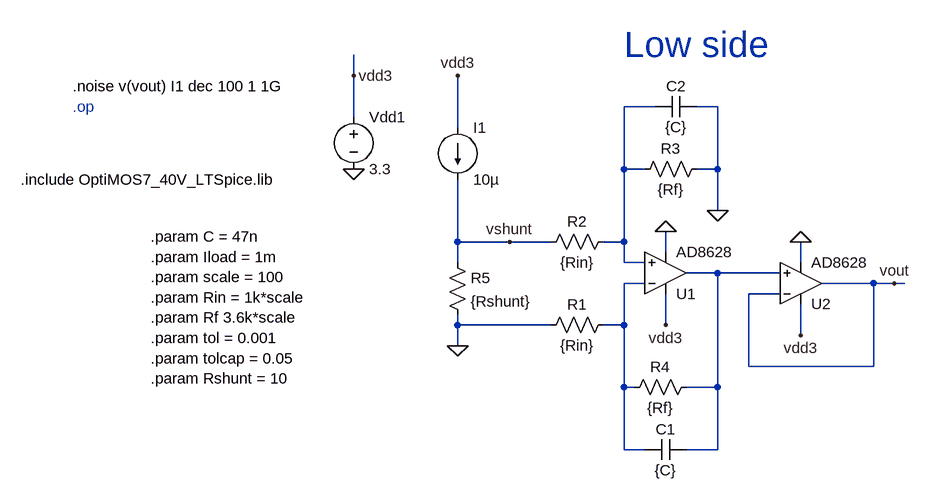
[diagram p0: schematic Preamp_uA_noise.asc]
Preamp_uA_noise.asc, the LTspice schematic file:
Version 4.1
SHEET 1 1036 680
WIRE 160 -32 160 -64
WIRE 624 16 576 16
WIRE 720 16 688 16
WIRE 160 32 160 -32
WIRE 320 48 320 -32
WIRE 576 112 576 16
WIRE 608 112 576 112
WIRE 720 112 720 16
WIRE 720 112 688 112
WIRE 720 176 720 112
WIRE 320 224 320 128
WIRE 400 224 320 224
WIRE 464 224 400 224
WIRE 576 224 576 112
WIRE 576 224 544 224
WIRE 640 240 640 208
WIRE 320 256 320 224
WIRE 576 256 576 224
WIRE 608 256 576 256
WIRE 848 256 848 224
WIRE 720 272 672 272
WIRE 816 272 720 272
WIRE 608 288 576 288
WIRE 960 288 880 288
WIRE 992 288 960 288
WIRE 1008 288 992 288
WIRE 816 304 768 304
WIRE 320 352 320 336
WIRE 464 352 320 352
WIRE 576 352 576 288
WIRE 576 352 544 352
WIRE 640 352 640 304
WIRE 848 368 848 320
WIRE 320 384 320 352
WIRE 768 416 768 304
WIRE 960 416 960 288
WIRE 960 416 768 416
WIRE 576 448 576 352
WIRE 592 448 576 448
WIRE 720 448 720 272
WIRE 720 448 672 448
WIRE 576 544 576 448
WIRE 608 544 576 544
WIRE 720 544 720 448
WIRE 720 544 672 544
FLAG 640 352 vdd3
FLAG 320 -32 vdd3
FLAG 320 384 0
FLAG 640 208 0
FLAG 720 176 0
FLAG 992 288 vout
FLAG 848 368 vdd3
FLAG 848 224 0
FLAG 160 112 0
FLAG 160 -32 vdd3
FLAG 400 224 vshunt
SYMBOL res 560 336 R90
WINDOW 0 0 56 VBottom 2
WINDOW 3 32 56 VTop 2
SYMATTR InstName R1
SYMATTR Value {Rin}
SYMBOL res 560 208 R90
WINDOW 0 0 56 VBottom 2
WINDOW 3 32 56 VTop 2
SYMATTR InstName R2
SYMATTR Value {Rin}
SYMBOL res 704 96 R90
WINDOW 0 0 56 VBottom 2
WINDOW 3 32 56 VTop 2
SYMATTR InstName R3
SYMATTR Value {Rf}
SYMBOL res 688 432 R90
WINDOW 0 0 56 VBottom 2
WINDOW 3 32 56 VTop 2
SYMATTR InstName R4
SYMATTR Value {Rf}
SYMBOL res 304 240 R0
SYMATTR InstName R5
SYMATTR Value {Rshunt}
SYMBOL cap 672 528 R90
WINDOW 0 0 32 VBottom 2
WINDOW 3 32 32 VTop 2
SYMATTR InstName C1
SYMATTR Value {C}
SYMBOL cap 688 0 R90
WINDOW 0 0 32 VBottom 2
WINDOW 3 32 32 VTop 2
SYMATTR InstName C2
SYMATTR Value {C}
SYMBOL OpAmps\\AD8628 640 336 M180
SYMATTR InstName U1
SYMBOL OpAmps\\AD8628 848 352 M180
SYMATTR InstName U2
SYMBOL voltage 160 16 R0
SYMATTR InstName Vdd1
SYMATTR Value 3.3
SYMBOL current 320 48 R0
WINDOW 123 0 0 Left 0
WINDOW 39 0 0 Left 0
SYMATTR InstName I1
SYMATTR Value 10µ
TEXT -152 216 Left 2 !.param C = 47n\n.param Iload = 1m\n.param scale = 100\n.param Rin = 1k*scale\n.param Rf 3.6k*scale\n.param tol = 0.001\n.param tolcap = 0.05\n.param Rshunt = 10
TEXT -272 16 Left 2 ;.op
TEXT 576 -80 Left 5 ;Low side
TEXT -352 128 Left 2 !.include OptiMOS7_40V_LTSpice.lib
TEXT -272 -16 Left 2 !.noise v(vout) I1 dec 100 1 1G

The netlist it stands for:
* Preamp_uA_noise.asc
R1 N003 0 {Rin}
R2 N001 vshunt {Rin}
R3 0 N001 {Rf}
R4 N002 N003 {Rf}
R5 vshunt 0 {Rshunt}
C1 N002 N003 {C}
C2 0 N001 {C}
X§U1 N001 N003 vdd3 0 N002 AD8628  ; pins In+ In- V+ V- OUT
X§U2 N002 vout vdd3 0 vout AD8628  ; pins In+ In- V+ V- OUT
Vdd1 vdd3 0 3.3
I1 vdd3 vshunt 10µ
.param C = 47n
.param Iload = 1m
.param scale = 100
.param Rin = 1k*scale
.param Rf 3.6k*scale
.param tol = 0.001
.param tolcap = 0.05
.param Rshunt = 10
* .op
* Low side
.include OptiMOS7_40V_LTSpice.lib
.noise v(vout) I1 dec 100 1 1G
.backanno
.end